# Altium schematic sheet KHOI_NGUON.SchDoc
size A3; SheetNumber: 10; SheetTotal: 10
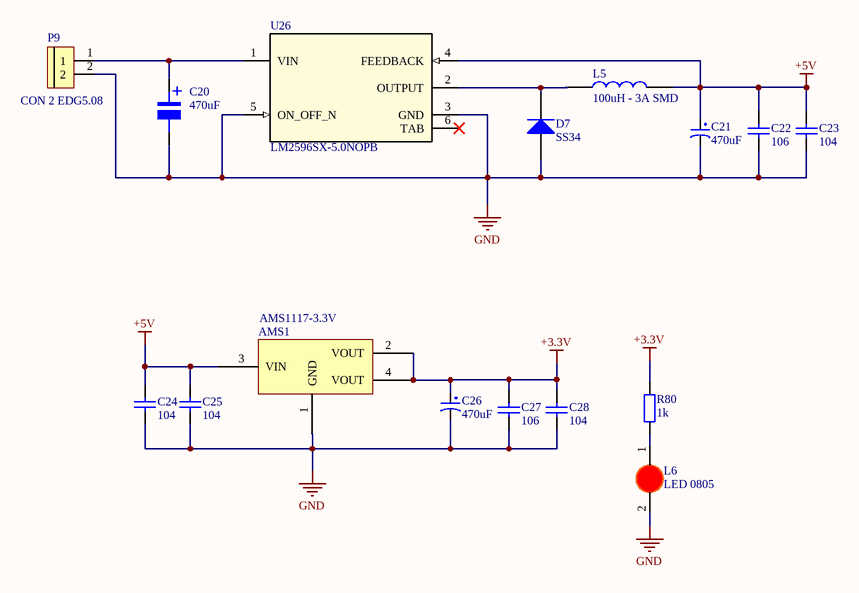
[diagram p0: KHOI_NGUON.SchDoc]

## Parts
AMS1  AMS1117-3.3V  [SOT223]
C20  470uF  [tu nhom 8 (f)]
C21  470uF  [tu hoa 8mm]
C22  106  [tu 0805]
C23  104  [tu 0805]
C24  104  [tu 0805]
C25  104  [tu 0805]
C26  470uF  [tu hoa 8mm]
C27  106  [tu 0805]
C28  104  [tu 0805]
D7  SS34  [DIODE SMA]
L5  100uH - 3A SMD  [Cuon Cam 12x12x10]
L6  LED 0805  [LED-0805-Red]
P9  CON 2 EDG5.08  [CON 2 2EDG5.08]
R80  1k  [tro smd 0805]
U26  LM2596SX-5.0NOPB  [KTT0005B]

## Nets
+3.3V: AMS1.2(VOUT) AMS1.4(VOUT) C26.1 C27.1 C28.1 R80.1
+5V: AMS1.3(VIN) C21.1 C22.1 C23.1 C24.1 C25.1 L5.2 U26.4(FEEDBACK)
GND: AMS1.1(GND) C20.2 C21.2 C22.2 C23.2 C24.2 C25.2 C26.2 C27.2 C28.2 D7.1(A) L6.2(K) P9.2 U26.3(GND) U26.5(ON_OFF_N)
NetC20_1: C20.1 P9.1 U26.1(VIN)
NetD7_2: D7.2(K) L5.1 U26.2(OUTPUT)
NetL6_1: L6.1(A) R80.2

Not connected (* = marked no-connect by the designer): U26 6(TAB)*

## Notes on the sheet
- (in symbol Tu Nhom 470uF 16V) +

## Library data of the parts
AMS1 = AMS1117 SMD: Dán; Value: AMS1117-3.3V SOT223; Don_Vi: Con; Ma_Hang: MH000596; Ghi_Chu: *; Kieu_Chan: *; Chung_Loai: Dán
C20 = Tu Nhom 470uF 16V: Dán; Don_Vi: Con; So_Chan: 2; Ten_Linh_Kien: Tụ Nhôm 470uF 16V 8x10.4MM; Ma_Hang: MH001940; Chung_Loai: Dán; Kieu_Chan: *
C21 C26 = Tu Hoa 470uF 16V 8x11: Cắm; Don_Vi: Con; So_Chan: 2; Ten_Linh_Kien: Tụ Hóa 470uF 16V 8x11MM; Ma_Hang: MH006550; Chung_Loai: Cắm; Kieu_Chan: *
C22 C27 = Tu 0805 106 16V 10%: Dán; Ten_Linh_Kien: Tụ 0805 106-10uF 10% 16V; So_Chan: 2; Don_Vi: Con; Ma_Hang: MH004553; Chung_Loai: Dán; Kieu_Chan: *
C23-C25 C28 = Tu 0805 104 50V 10%: Dán; Don_Vi: Con; So_Chan: 2; Ten_Linh_Kien: Tụ 0805 104-100nF 10% 50V; Ma_Hang: MH004551; Chung_Loai: Dán; Kieu_Chan: *
D7 = Diode SS34 ( 1N5822 ): Dán; Don_Vi: Con; Ma_Hang: MH002104; Ten_Linh_Kien: Diode SS34 3A 40V SMA ( 1N5822 SS34A); Kieu_Chan: *; Chung_Loai: Dán
L5 = CUON CAM 100uH SMD: Dán; Don_Vi: Con; Ma_Hang: MH003999; Ten_Linh_Kien: Cuộn Cảm 100uH 7x7x4MM CD74; Ma_Hang: *; Kieu_Chan: *; Chung_Loai: Dán
L6 = LED 0805 Do: Dán; Don_Vi: Con; Ma_Hang: MH000897; Ten_Linh_Kien: LED 0805 Màu Đỏ (Red); Ghi_Chu: *; Kieu_Chan: *; Chung_Loai: Dán
P9 = CON 2 EDG5.08: Cắm; Ten_Linh_Kien: CON 2 2EDG5.08-2P 5.08MM ( Xanh Cong); Ma_Hang: MH000759; Ghi_Chu: *; Don_Vi: Con; Kieu_Chan: *; Chung_Loai: Cắm
R80 = Tro 0805 1% 1k: Dán; Don_Vi: Con; So_Chan: 2; Ten_Linh_Kien: Trở 0805 1% 1k; Ma_Hang: MH005468; Chung_Loai: Dán; Kieu_Chan: *
U26 = LM2596SX-5.0NOPB: No Description Available; Mfr_Name: Texas Instruments; PartNumber: LM2596SX-ADJ/NOPB; Alternate_PartNumber: LM2596S-ADJ/NOPB; CompType: IC; TYPE: TYPE; RefDes: RefDes; PackageReference: KTT0005B; MountType: SMT; RoHS: Y; Manufacturer: Texas Instruments